# Altium schematic sheet LAUNCHXL-F28069_B_1400922_5.SchDoc: LAUNCHXL-F28069_B_1400922
size 301 x 234 mm; Origin: Eagle; Date: 2014/12/8 15:08:46; SheetNumber: 6; GateName_1: G$1; SymbolName_1: FRAME_A_L; LibraryName: frames; DeviceSetName: FRAME_A_L; GateName_2: G$2; SymbolName_2: DOCFIELD; Sheet: Sheet:; REV: REV:; COMPANY: COMPANY:; Scale:1/1: Scale: 1/1; Drawn: Drawn; Checked: Checked; Approved: Approved; Embest: Embest
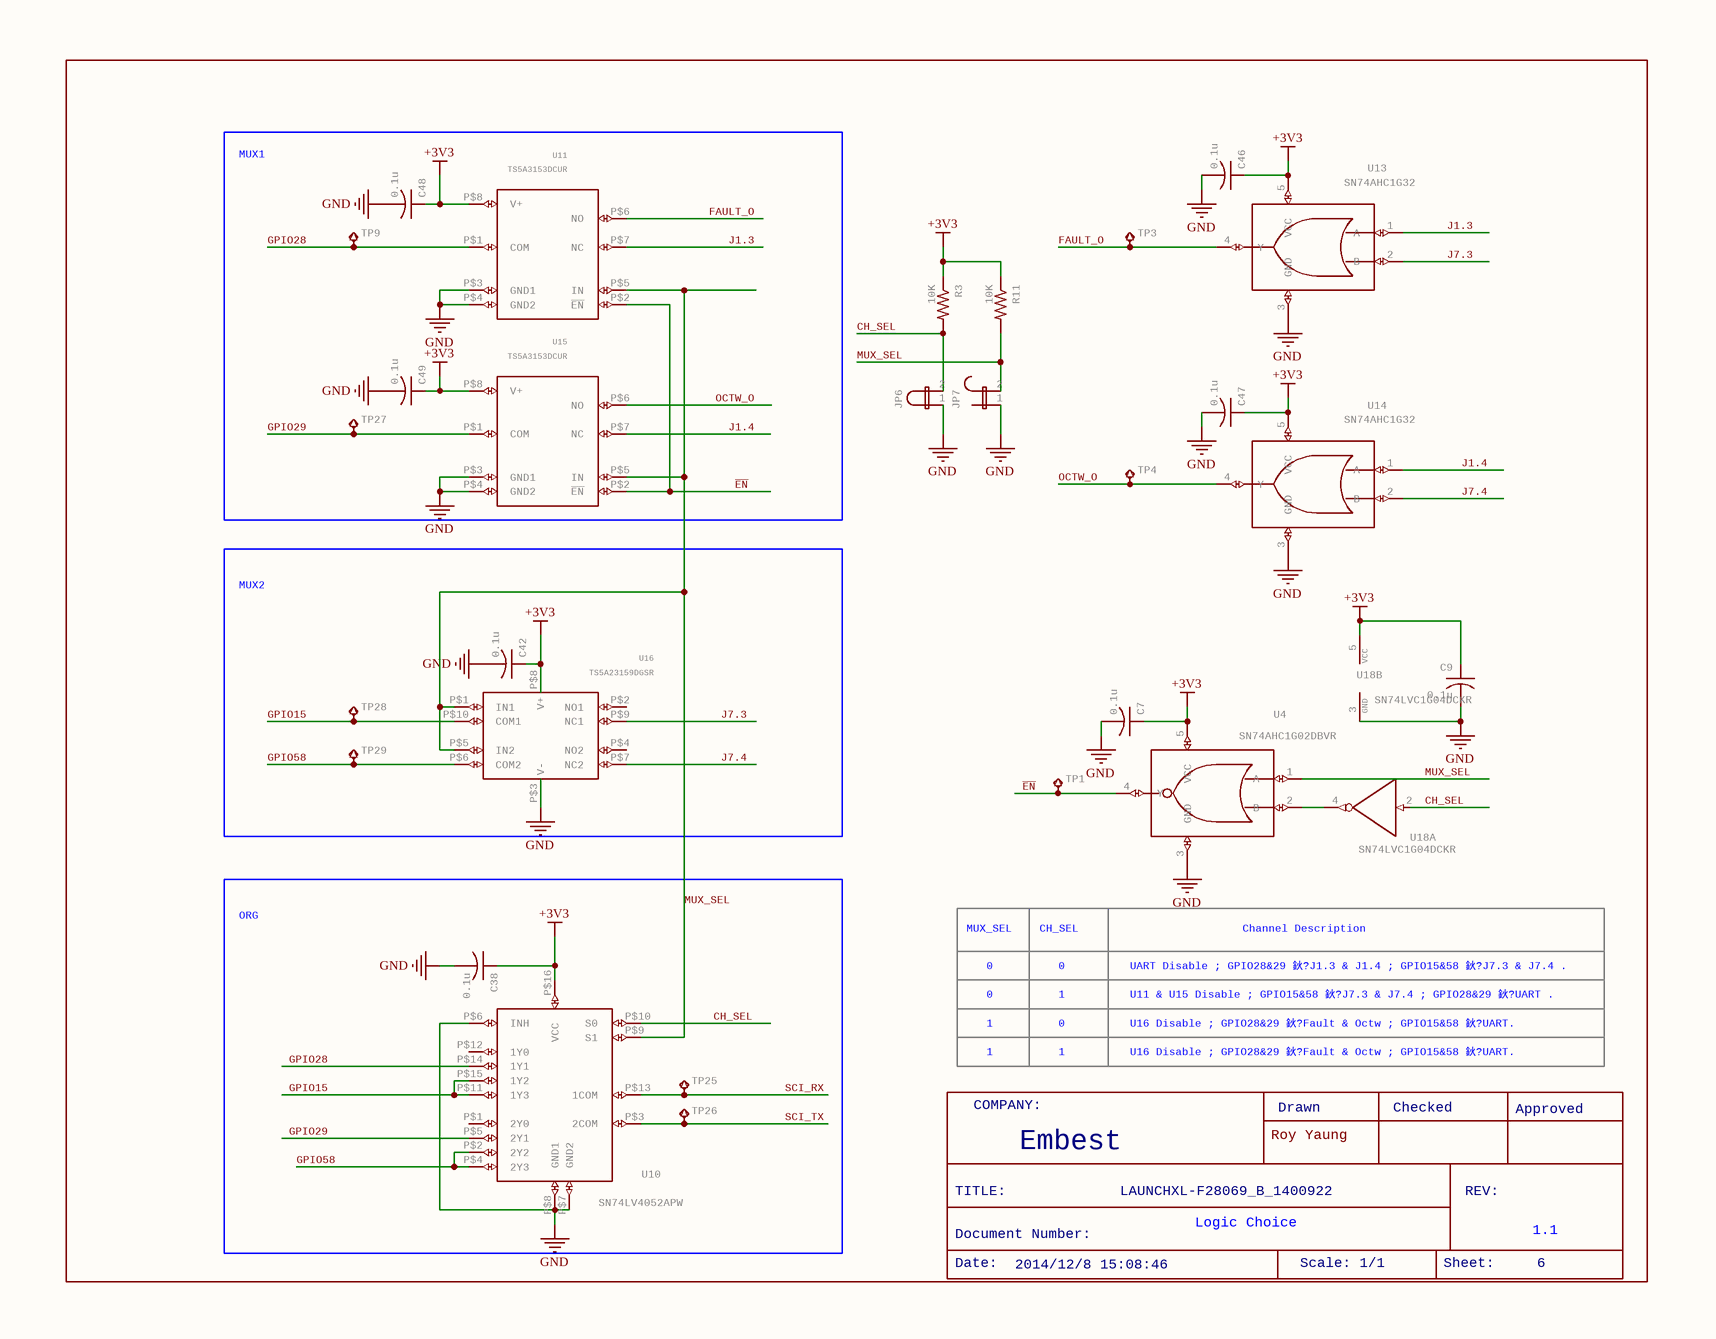
[diagram p0: LAUNCHXL-F28069_B_1400922_5.SchDoc]

## Parts
C7  0.1u  [C0402]
C9  0.1u  [C0402]
C38  0.1u  [C0402]
C42  0.1u  [C0402]
C46  0.1u  [C0402]
C47  0.1u  [C0402]
C48  0.1u  [C0402]
C49  0.1u  [C0402]
JP6  JP1ENORM  [JP1]  (value not drawn)
JP7  JP1ENORM  [JP1]  (value not drawn)
R3  10K  [R0402]
R11  10K  [R0402]
TP1  TESTPAD_TPB1,27  [TESTPAD_B1,27]  (value not drawn)
TP3  TESTPAD_TPB1,27  [TESTPAD_B1,27]  (value not drawn)
TP4  TESTPAD_TPB1,27  [TESTPAD_B1,27]  (value not drawn)
TP9  TESTPAD_TPB1,27  [TESTPAD_B1,27]  (value not drawn)
TP25  TESTPAD_TPB1,27  [TESTPAD_B1,27]  (value not drawn)
TP26  TESTPAD_TPB1,27  [TESTPAD_B1,27]  (value not drawn)
TP27  TESTPAD_TPB1,27  [TESTPAD_B1,27]  (value not drawn)
TP28  TESTPAD_TPB1,27  [TESTPAD_B1,27]  (value not drawn)
TP29  TESTPAD_TPB1,27  [TESTPAD_B1,27]  (value not drawn)
U4  SN74AHC1G02DBVR  [SOT23-5-DBV]
U10  SN74LV4052APW  [TSSOP16-PW]
U11  TS5A3153DCUR  [TI-DCU8]
U13  SN74AHC1G32  [SOT23-5-DBV]
U14  SN74AHC1G32  [SOT23-5-DBV]
U15  TS5A3153DCUR  [TI-DCU8]
U16  TS5A23159DGSR  [TI-DGS10]
U18  SN74LVC1G04DCKR  [74XX-LITTLE-DE_SC70-5]  (parts A,B of 2)
U$1  ROY_JUMPER  [ROY_JUMPER]  (value not drawn)
U$2  ROY_JUMPER  [ROY_JUMPER]  (value not drawn)

## Blocks framed on the sheet
MUX1: C48 C49 TP9 TP27 U11 U15
MUX2: C42 TP28 TP29 U16
ORG: C38 TP25 TP26 U10

## Nets
+3V3: C7.1 C9.1 C38.1 C42.1 C46.1 C47.1 C48.1 C49.1 R3.1 R11.1 U4.5(VCC) U10.P$16(VCC) U11.P$8(V+) U13.5(VCC) U14.5(VCC) U15.P$8(V+) U16.P$8(V+) U18.5(VCC)
GND: C7.2 C9.2 C38.2 C42.2 C46.2 C47.2 C48.2 C49.2 JP6.1 JP7.1 U4.3(GND) U10.P$6(INH) U10.P$7(GND2) U10.P$8(GND1) U11.P$3(GND1) U11.P$4(GND2) U13.3(GND) U14.3(GND) U15.P$3(GND1) U15.P$4(GND2) U16.P$3(V-) U18.3(GND)
CH_SEL: JP6.2 R3.2 U10.P$10(S0) U18.2(I)
~{EN}: TP1.TP U4.4(Y) U11.P$2(~{EN}) U15.P$2(~{EN})
FAULT_O: TP3.TP U11.P$6(NO) U13.4(Y)
GPIO15: TP28.TP U10.P$11(1Y3) U10.P$15(1Y2) U16.P$10(COM1)
GPIO28: TP9.TP U10.P$14(1Y1) U11.P$1(COM)
GPIO29: TP27.TP U10.P$5(2Y1) U15.P$1(COM)
GPIO58: TP29.TP U10.P$2(2Y2) U10.P$4(2Y3) U16.P$6(COM2)
J1.3: U11.P$7(NC) U13.1(A)
J1.4: U14.1(A) U15.P$7(NC)
J7.3: U13.2(B) U16.P$9(NC1)
J7.4: U14.2(B) U16.P$7(NC2)
MUX_SEL: JP7.2 R11.2 U4.1(A) U10.P$9(S1) U11.P$5(IN) U15.P$5(IN) U16.P$1(IN1) U16.P$5(IN2)
OCTW_O: TP4.TP U14.4(Y) U15.P$6(NO)
SCI_RX: TP25.TP U10.P$13(1COM)
SCI_TX: TP26.TP U10.P$3(2COM)
NetU4_2: U4.2(B) U18.4(O)

Not connected (* = marked no-connect by the designer): U10 P$1(2Y0) P$12(1Y0); U16 P$2(NO1) P$4(NO2)

## Notes on the sheet
- MUX_SEL
- CH_SEL
- Channel Description
- 0
- 1
- UART Disable ; GPIO28&29 鈥?J1.3 & J1.4 ; GPIO15&58 鈥?J7.3 & J7.4 .
- U11 & U15 Disable ; GPIO15&58 鈥?J7.3 & J7.4 ; GPIO28&29 鈥?UART .
- U16 Disable ; GPIO28&29 鈥?Fault & Octw ; GPIO15&58 鈥?UART.
- COMPANY:
- Roy Yaung
- Drawn
- Checked
- Approved
- TITLE:
- Embest
- LAUNCHXL-F28069_B_1400922
- REV:
- Date:
- Document Number:
- 2014/12/8 15:08:46
- Logic Choice
- Scale: 1/1
- Sheet:
- 1.1
- 6

## Library data of the parts
C7 C9 C38 C42 C46-C49 = C-USC0402: CAPACITOR, American symbol; GateName_1: G$1; SymbolName_1: C-US; DeviceName: C0402; LibraryName: rcl; DeviceSetName: C-US
JP6 JP7 = JP1ENORM: JUMPER; GateName_1: A; SymbolName_1: JP2E; DeviceName: NORM; DeviceSetName: JP1E; LibraryName: jumper
R3 R11 = R-US_R0402: RESISTOR, American symbol; GateName_1: G$1; SymbolName_1: R-US; DeviceSetName: R-US_; DeviceName: R0402; LibraryName: rcl
TP1 TP3 TP4 TP9 TP25-TP29 = TESTPAD_TPB1,27: Test pad; GateName_1: G$1; DeviceName: B1,27; SymbolName_1: TESTPAD_TP; LibraryName: RF430FRL152H_EVM_a; DeviceSetName: TESTPAD_TP
U4 = SN74AHC1G02: GateName_1: G$1; SymbolName_1: 74HC1G02A; LibraryName: LAUNCHXL-F28027; DeviceSetName: SN74AHC1G02
U10 = SN74LV4052APW: GateName_1: G$1; SymbolName_1: 74LV4052; LibraryName: LAUNCHXL-F28027; DeviceSetName: SN74LV4052APW
U11 U15 = TS5A3153DCUR: GateName_1: G$1; SymbolName_1: TS5A3153; LibraryName: LAUNCHXL-F28027; DeviceSetName: TS5A3153DCUR
U13 U14 = SN74AHC1G32: GateName_1: G$1; SymbolName_1: 74HC1G32A; LibraryName: LAUNCHXL-F28027; DeviceSetName: SN74AHC1G32
U16 = TS5A23159DGSR: GateName_1: G$1; SymbolName_1: TS5A23159; LibraryName: LAUNCHXL-F28027; DeviceSetName: TS5A23159DGSR
U18 = 74XX-LITTLE-DE_74*1G04DCK: INVERTER Gate; GateName_1: A; SymbolName_1: 74XX-LITTLE-DE_7404; GateName_2: P; SymbolName_2: 74XX-LITTLE-DE_PWRN; DeviceName: DCK; LibraryName: RF430FRL152H_EVM_a; DeviceSetName: 74XX-LITTLE-DE_74*1G04
U$1 U$2 = ROY_JUMPER: GateName_1: G$1; SymbolName_1: ROY_JUMPER; LibraryName: roy; DeviceSetName: ROY_JUMPER